# Altium schematic sheet TEC_Laser.SchDoc
size A3; SheetNumber: 1; SheetTotal: 1
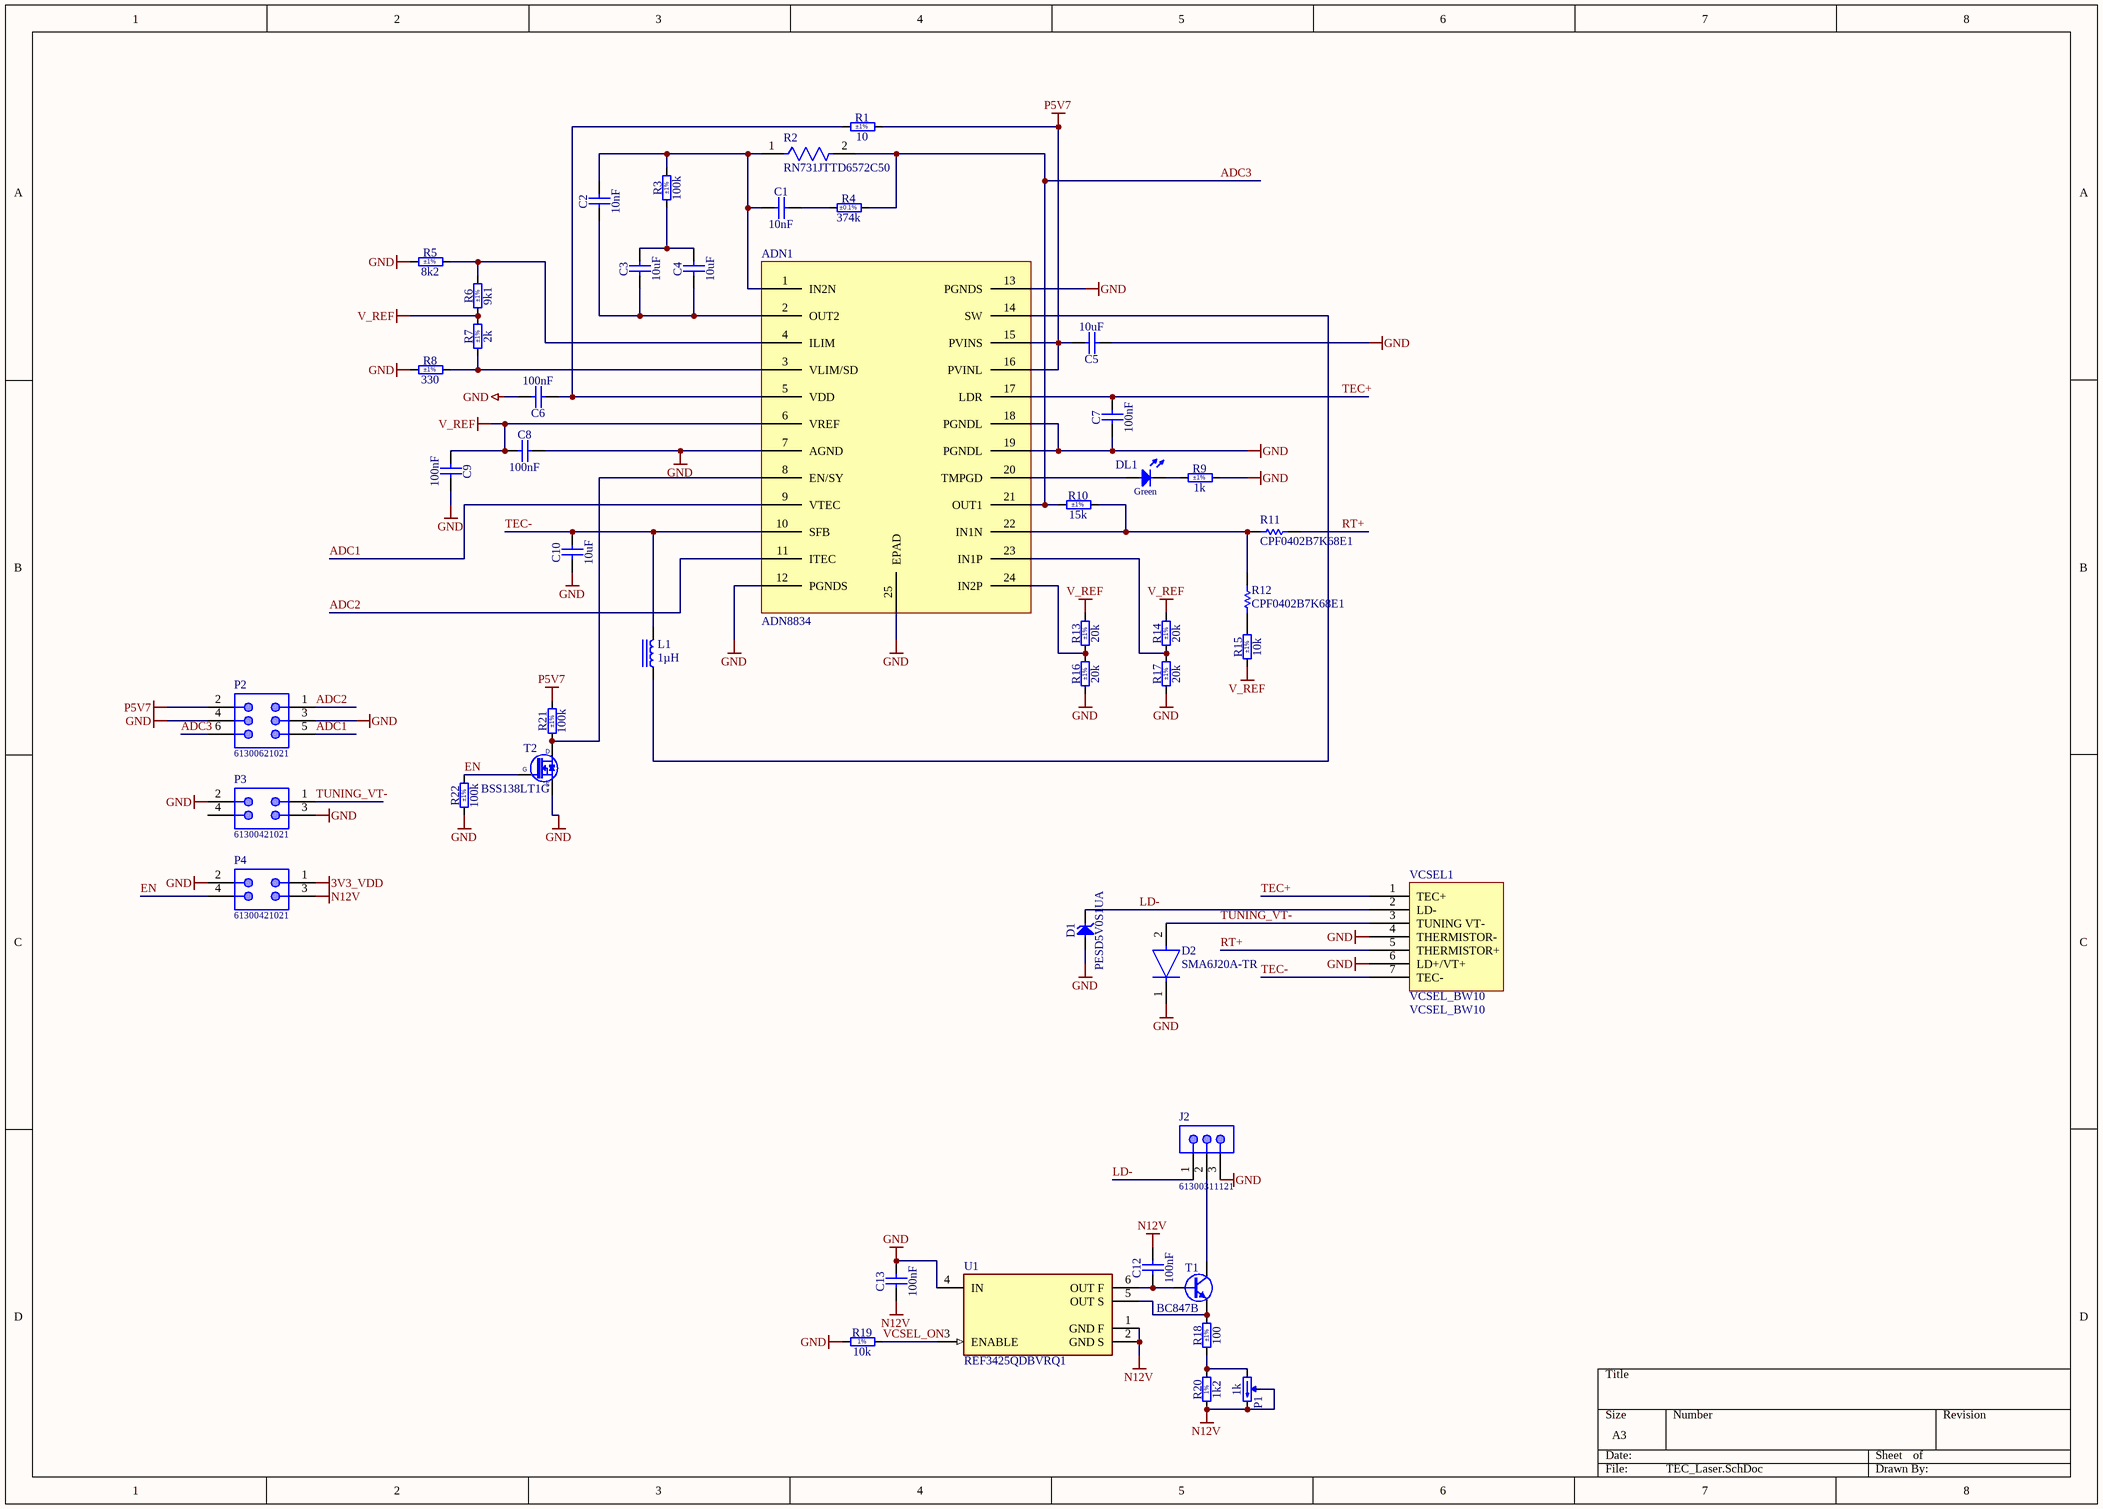
[diagram p0: TEC_Laser.SchDoc]

## Parts
ADN1  ADN8834  [SMSC QFN-24 4x4MM]
C1  10nF  [CAPC1005X55N]
C2  10nF  [CAPC1005X55N]
C3  10uF  [CAPC1608X80N]
C4  10uF  [CAPC1608X80N]
C5  10uF  [CAPC1005X70N]
C6  100nF  [CAPC1005X55N]
C7  100nF  [CAPC1005X55N]
C8  100nF  [CAPC1005X55N]
C9  100nF  [CAPC1005X55N]
C10  10uF  [CAPC1005X70N]
C12  100nF  [CAPC1005X55N]
C13  100nF  [CAPC1005X55N]
D1  PESD5V0S1UA  [SOD2512X110N]
D2  SMA6J20A-TR  [FP-SMA-MFG]
DL1  Green  [LED_OSRAM_LGL29K]
J2  61300311121  [61300311121]
L1  1µH  [IND 0806_2016]
P1  1k  [TRIM_VISHAY_T63XB]
P2  61300621021  [61300621021]
P3  61300421021  [61300421021]
P4  61300421021  [61300421021]
R1  10  Tolerance: ±1%  [RESC1005X40N]
R2  RN731JTTD6572C50  [FP-RN731J-IPC_B]
R3  100k  Tolerance: ±1%  [RESC1005X40N]
R4  374k  Tolerance: ±0.1%  [RESC1608X55N]
R5  8k2  Tolerance: ±1%  [RESC1005X40N]
R6  9k1  Tolerance: ±1%  [RESC1005X40N]
R7  2k  Tolerance: ±1%  [RESC1005X40N]
R8  330  Tolerance: ±1%  [RESC1005X40N]
R9  1k  Tolerance: ±1%  [RESC1005X40N]
R10  15k  Tolerance: ±1%  [RESC1005X40N]
R11  CPF0402B7K68E1  [RESC1005X35X20NL05T10]
R12  CPF0402B7K68E1  [RESC1005X35X20NL05T10]
R13  20k  Tolerance: ±1%  [RESC1005X40N]
R14  20k  Tolerance: ±1%  [RESC1005X40N]
R15  10k  Tolerance: ±1%  [RESC1005X40N]
R16  20k  Tolerance: ±1%  [RESC1005X40N]
R17  20k  Tolerance: ±1%  [RESC1005X40N]
R18  100  Tolerance: ±1%  [RESC1005X40N]
R19  10k  [RESC1005X40N]
R20  1k2  [RESC1005X40N]
R21  100k  Tolerance: ±1%  [RESC1005X40N]
R22  100k  Tolerance: ±1%  [RESC1005X40N]
T1  BC847B  [SOT95P230X110-3N]
T2  BSS138LT1G  [SOT95P240X110-3N]
U1  REF3425QDBVRQ1  [FP-DBV0006A-MFG]
VCSEL1  VCSEL_BW10  [VCSEL_BW10]

## Nets
3V3_VDD: P4.1
GND: ADN1.7(AGND) ADN1.12(PGNDS) ADN1.13(PGNDS) ADN1.18(PGNDL) ADN1.19(PGNDL) ADN1.25(EPAD) C5.1 C6.2 C7.1 C8.2 C9.2 C10.1 C13.2 D1.2(A) D2.1(C) J2.3 P2.3 P2.4 P3.2 P3.3 P4.2 R5.1 R8.1 R9.2 R16.1 R17.1 R19.1 R22.1 T2.2(S) U1.4(IN) VCSEL1.4(THERMISTOR-) VCSEL1.6(LD+/VT+)
N12V: C12.2 C13.1 P1.2(W) P1.3(CW) P4.3 R20.1 U1.1(GND_F) U1.2(GND_S)
P5V7: ADN1.15(PVINS) ADN1.16(PVINL) C5.2 P2.2 R1.2 R21.2
V_REF: ADN1.6(VREF) C8.1 C9.1 R6.1 R7.2 R13.2 R14.2 R15.1
ADC1: ADN1.9(VTEC) P2.5
ADC2: ADN1.11(ITEC) P2.1
ADC3: ADN1.21(OUT1) P2.6 R2.2 R4.2 R10.1
EN: P4.4 R22.2 T2.1(G)
LD-: D1.1(C) J2.1 VCSEL1.2(LD-)
RT+: R11.2 VCSEL1.5(THERMISTOR+)
TEC+: ADN1.17(LDR) C7.2 VCSEL1.1(TEC+)
TEC-: ADN1.10(SFB) C10.2 L1.2 VCSEL1.7(TEC-)
TUNING_VT-: D2.2(A) P3.1 VCSEL1.3(TUNING_VT-)
VCSEL_ON: R19.2 U1.3(ENABLE)
NetADN1_1: ADN1.1(IN2N) C1.1 C2.2 R2.1 R3.2
NetADN1_2: ADN1.2(OUT2) C2.1 C3.1 C4.1
NetADN1_3: ADN1.3(VLIM/SD) R7.1 R8.2
NetADN1_4: ADN1.4(ILIM) R5.2 R6.2
NetADN1_5: ADN1.5(VDD) C6.1 R1.1
NetADN1_8: ADN1.8(EN/SY) R21.1 T2.3(D)
NetADN1_14: ADN1.14(SW) L1.1
NetADN1_20: ADN1.20(TMPGD) DL1.2(A)
NetADN1_22: ADN1.22(IN1N) R10.2 R11.1 R12.2
NetADN1_23: ADN1.23(IN1P) R14.1 R17.2
NetADN1_24: ADN1.24(IN2P) R13.1 R16.2
NetC1_2: C1.2 R4.1
NetC3_2: C3.2 C4.2 R3.1
NetC12_1: C12.1 T1.1(B) U1.6(OUT_F)
NetDL1_1: DL1.1(C) R9.1
NetJ2_2: J2.2 T1.3(C)
NetP1_1: P1.1(CCW) R18.1 R20.2
NetR12_1: R12.1 R15.2
NetR18_2: R18.2 T1.2(E) U1.5(OUT_S)

Not connected (* = marked no-connect by the designer): P3 4

## Notes on the sheet
- (in symbol R0402_1K2_1%_0.0625W_100PPM) 1%
- (in symbol R0402_10K_1%_0.0625W_100PPM) 1%

## Library data of the parts
ADN1 = ADN8834: TEC
C1 C2 = CC0402_10NF_16V_10%_X7R: Non-polarised capacitor; Part Description: SMD Multilayer Chip Ceramic Capacitor; Manufacturer: GENERIC; Manufacturer1 Part Number: 223878715636; Voltage: 16V; TC: X7R; Tolerance: ±10%; Part Number: CC0402_10NF_16V_10%_X7R; Component Kind: Standard; Component Type: Standard; Pin Count: 2; Value: 10nF; Status: Not Recommended; Manufacturer Part Number: CC0402_10NF_16V_10%_X7R; Case: 0402; Mounted: Yes; Socket: No; SMD: Yes; Sense: No; Manufacturer1 Example: PHYCOMP; Manufacturer1 ComponentHeight: 0.55mm; HelpURL: \\cern.ch\dfs\Applications\Altium\Datasheets\CC0402_X7R_PHYCOMP.pdf; Author: CERN DEM JLC; CreateDate: 03.12.2007; LatestRevisionDate: 03.12.2007
C3 C4 = CC0603_10UF_16V_20%_X5R: Non-polarised capacitor; Part Description: SMD Multilayer Chip Ceramic Capacitor; Manufacturer: GENERIC; Manufacturer1 Part Number: GRM188R61C106MA73D; Voltage: 16V; TC: X5R; Tolerance: ±20%; Part Number: CC0603_10UF_16V_20%_X5R; Component Kind: Standard; Component Type: Standard; Pin Count: 2; Value: 10uF; Status: None; Manufacturer Part Number: CC0603_10UF_16V_20%_X5R; Case: 0603; Mounted: Yes; Socket: No; SMD: Yes; Sense: No; Manufacturer1 Example: MURATA; Manufacturer1 ComponentHeight: 0.8mm; HelpURL: \\cern.ch\dfs\Applications\Altium\Datasheets\CC0603_X5R_MURATA_GRM.pdf; Author: CERN DEM MR; CreateDate: 02.03.2016; LatestRevisionDate: 02.03.2016
C5 C10 = CC0402_10UF_6.3V_20%_X5R: Non-polarised capacitor; Part Description: SMD Multilayer Chip Ceramic Capacitor; Manufacturer: GENERIC; Manufacturer1 Part Number: C1005X5R0J106M050BC; Voltage: 6.3V; TC: X5R; Tolerance: ±10%; Part Number: CC0402_10UF_6.3V_20%_X5R; Component Kind: Standard; Component Type: Standard; Pin Count: 2; Value: 10uF; Status: Preferred; Manufacturer Part Number: CC0402_10UF_6.3V_20%_X5R; Case: 0402; Mounted: Yes; Socket: No; SMD: Yes; Sense: No; Manufacturer1 Example: TDK; Manufacturer1 ComponentHeight: 0.70mm; HelpURL: \\cern.ch\dfs\Applications\Altium\Datasheets\CC0402_X5R_TDK_C.pdf; Author: CERN DEM JLC; CreateDate: 07.01.2015; LatestRevisionDate: 07.01.2015
C6-C9 C12 C13 = CC0402_100NF_16V_10%_X7R: Non-polarised capacitor; Part Description: SMD Multilayer Chip Ceramic Capacitor; Manufacturer: GENERIC; Manufacturer1 Part Number: GRM155R71C104KA88D; Voltage: 16V; TC: X7R; Tolerance: ±10%; Part Number: CC0402_100NF_16V_10%_X7R; Component Kind: Standard; Component Type: Standard; Pin Count: 2; Value: 100nF; Status: Not Recommended; Manufacturer Part Number: CC0402_100NF_16V_10%_X7R; Case: 0402; Mounted: Yes; Socket: No; SMD: Yes; Sense: No; Manufacturer1 Example: MURATA; Manufacturer1 ComponentHeight: 0.55mm; HelpURL: \\cern.ch\dfs\Applications\Altium\Datasheets\CC0402_X7R_MURATA_GRM.pdf; Author: CERN DEM JLC; CreateDate: 05.12.2013; LatestRevisionDate: 03.12.2007
D1 = PESD5V0S1UA: Transient Voltage Suppressor Diode (Uni-Directional); Part Description: Unidirectional ESD Protection for Transient Voltage Suppression; Manufacturer: NXP SEMICONDUCTORS; Voltage: 5V; Power: 890W; PressFit: No; Bonding: No; Part Number: PESD5V0S1UA; Component Kind: Standard; Component Type: Standard; Device: PESD5V0S1UA; PackageDescription: Small Outline Diode (SOD-323), 1.70mm W X 1.25mm L X 1.10mm H body,  IPC Medium Density; Manufacturer Part Number: PESD5V0S1UA; Pin Count: 2; Case: SOD-323; Mounted: Yes; Socket: No; SMD: Yes; Sense: No; ComponentHeight: 1.1mm; HelpURL: \\cern.ch\dfs\Applications\Altium\Datasheets\PESD5V0S1UA.pdf; Author: CERN DEM JLC; CreateDate: 28.08.2012; LatestRevisionDate: 18.09.2013
D2 = CMP-12225-000059-1: TVS DIODE 20V 36.8V SMA; Number of Unidirectional Channels: 1; Leakage Current: 200nA; Power Dissipation: 600W; Max Breakdown Voltage: 24.5V; Max Power Dissipation: 4W; Reverse Breakdown Voltage: 22.2V; Element Configuration: Single; Power Line Protection: No; Test Current: 1mA; Peak Pulse Current: 93A; Polarity: Unidirectional; Breakdown Voltage: 23.4V; Max Surge Current: 60A; Width: 2.9mm; Termination: SMD/SMT; Reverse Standoff Voltage: 20V; Radiation Hardening: No; Max Operating Temperature: 175°C; Package Quantity: 1; Lead Free: Lead Free; Number of Elements: 1; Length: 4.6mm; Case/Package: SMA; Mount: Surface Mount; Max Reverse Leakage Current: 200nA; Number of Channels: 1; Clamping Voltage: 36.8V; REACH SVHC: No SVHC; Number of Pins: 2; Peak Pulse Power: 600W; Min Breakdown Voltage: 22.2V; Height: 2.03mm; Operating Supply Voltage: 20V; Min Operating Temperature: -55°C; Packaging: Tape and Reel; Direction: Unidirectional; Composition: Zener
DL1 = LED_OSRAM_LG L29K-G2J1-24-Z: LED Green 1C 2A; Part Description: Surface Mount Green LED (0603 Case); Manufacturer: OSRAM; PressFit: No; Bonding: No; Status Comment: Sourcing Difficulty; Part Number: LED_OSRAM_LG L29K-G2J1-24-Z; Component Kind: Standard; Component Type: Standard; Color: Green; PackageDescription: Green Chip LED, 2-Leads, Body 1.7x0.8mm, IPC Medium Density; Manufacturer Part Number: LG L29K-G2J1-24-Z; Pin Count: 2; Case: 0603; Mounted: Yes; Socket: No; SMD: Yes; Sense: No; ComponentHeight: 0.67mm; HelpURL: \\cern.ch\dfs\Applications\Altium\Datasheets\LED_OSRAM_LGL29K.pdf; Author: CERN DEM JLC; CreateDate: 24.04.2012; LatestRevisionDate: 24.04.2012; Status: Not Recommended
J2 = 61300311121: WR-PHD Pin Header, THT, pitch 2.54mm, Single Row, Vertical, 3pin; Pin Number: 3; Gender: Male; Rated Current: 3A; Working Voltage: 250VAC; Withstanding Voltage: 500VAC; Contact Resistance: 20mOhm; ComponentLink1Description: Manufacturer; ComponentLink1URL: http://www.we-online.de; ComponentLink2Description: Datasheet; ComponentLink2URL: https://katalog.we-online.de/em/datasheet/6130xx11121.pdf; Part Number: 61300311121; Published Date: June 2019; Publisher: Wurth Elektronik; Pitch: 2.54mm; Operating Temperature: -40 to +105degC; Mounting Technology: THT; Packaging: Bag; Row Number: Single; Orientation: Vertical
L1 = SDED20161T-1R0MS: FIXED IND 1UH 1.7A 107MOHM SMD; Manufacturer: Delta Electronics/Cyntec; Current - Saturation: 1.8A; DC Resistance (DCR): 107mOhm Max; Inductance Frequency - Test: 1MHz; Material - Core: 0806 (2016 Metric); Shielding: Shielded; Tolerance: ±20%; Part Number: SDED20161T-1R0MS; ComponentLink1Description: Datasheet; ComponentLink1URL: http://www.cyntec.com/upfile/products/download/SDED20161T-000%20(A6).pdf; ComponentLink2Description: DigiKey Link; ComponentLink2URL: http://digikey.com/product-detail/en/delta-electronics-cyntec/SDED20161T-1R0MS/2037-SDED20161T-1R0MSCT-ND/10315404; Current Rating (Amps): 1.7A; Device Package: 0806 (2016 Metric); Height - Seated (Max): 0.039" (1.00mm); Inductance: 1µH; LastUpdated: 02.09.2020 01:24:38; Lifecycle Status: Active; Minimum Order: 1; Mounting Type: Surface Mount; Operating Temperature: -55°C ~ 125°C; Package / Case: 0806 (2016 Metric); Packaging: TapeAndReel; PartId: 2787; Part Status: Active; Price: 0.09; Series: SDED20161T; Size / Dimension: 0.079" L x 0.063" W (2.00mm x 1.60mm); Supplier 1: DigiKey; Supplier Part Number 1: 2037-SDED20161T-1R0MSCT-ND; Supplier Device Package: 0806; Value: 1µH
P1 = TRIM_14T_1K_VISHAY_T63XB102KT20: Trimming Potentiometer; Part Description: 15 Turn ± 5 Trimming Potentiometer (Side Adjustment); Manufacturer: VISHAY SFERNICE; Power: 0.25W; TC: ±100ppm/°C; Tolerance: ±10%; PressFit: No; Part Number: TRIM_14T_1K_VISHAY_T63XB102KT20; Component Kind: Standard; Component Type: Standard; Pin Count: 3; Value: 1k; Manufacturer Part Number: T63XB102KT20; Case: T63XB; Mounted: Yes; Socket: No; SMD: No; Sense: No; ComponentHeight: 7mm; HelpURL: \\cern.ch\dfs\Applications\Altium\Datasheets\TRIM_VISHAY_T63XB.pdf; Author: CERN DEM JLC; CreateDate: 16.10.2013; LatestRevisionDate: 16.10.2013
P2 = 61300621021: WR-PHD Pin Header, THT, pitch 2.54mm, Dual Row, Angled, 6p; Manufacturer: Wurth Elektronik; Pin Number: 6; Rated Current: 3A; Working Voltage: 250VAC; Withstanding Voltage: 500VAC; Contact Resistance: 20mOhm; ComponentLink1Description: Manufacturer; ComponentLink1URL: http://www.we-online.de; ComponentLink2Description: Datasheet; ComponentLink2URL: https://www.we-online.com/catalog/datasheet/61300621021.pdf; Manufacturer Part Number: 61300621021; Published Date: May 2020; Pitch: 2.54mm; Operating Temperature: -40 to +105degC; Mounting Technology: THT; Packaging: Bag; Gender: Pin Header; Row Number: Dual; Orientation: Angled
P3 P4 = 61300421021: WR-PHD Pin Header, THT, pitch 2.54mm, Dual Row, Angled, 4p; Manufacturer: Wurth Elektronik; Pin Number: 4; Rated Current: 3A; Working Voltage: 250VAC; Withstanding Voltage: 500VAC; Contact Resistance: 20mOhm; ComponentLink1Description: Manufacturer; ComponentLink1URL: http://www.we-online.de; ComponentLink2Description: Datasheet; ComponentLink2URL: https://www.we-online.com/catalog/datasheet/61300421021.pdf; Manufacturer Part Number: 61300421021; Published Date: May 2020; Pitch: 2.54mm; Operating Temperature: -40 to +105degC; Mounting Technology: THT; Packaging: Bag; Gender: Pin Header; Row Number: Dual; Orientation: Angled
R1 = R0402_10R_1%_0.0625W_200PPM: Resistor - 1%; Part Description: General Purpose Thick Film Chip Resistor; Manufacturer: GENERIC; Manufacturer1 Part Number: 232270671009L; TC: ±200ppm/°C; PressFit: No; Part Number: R0402_10R_1%_0.0625W_200PPM; Component Kind: Standard; Component Type: Standard; Pin Count: 2; Value: 10; Status: Not Recommended; Power: 0.0625W; Manufacturer Part Number: R0402_10R_1%_0.0625W_200PPM; Case: 0402; Mounted: Yes; Sense: No; Socket: No; SMD: Yes; Manufacturer1 Example: YAGEO PHYCOMP; Manufacturer1 ComponentHeight: 0.4mm; HelpURL: \\cern.ch\dfs\Applications\Altium\Datasheets\R0402_Phycomp_RC0402.pdf; Author: CERN DEM JLC; CreateDate: 24.06.2009; LatestRevisionDate: 17.10.2012
R2 = CMP-04015-036220-1: 65.7kΩ ±0.25% 0.063W, 1/16W Chip Resistor 0603 (1608 Metric) Moisture Resistant Thin Film; Voltage Rating: 50V; Resistance: 65.7kR; Temperature Coefficient: 50ppm/°C; Power Rating: 63mW; Case Code (Metric): 1608; Length: 1.6mm; Packaging: Tape and Reel; Case/Package: 0603; Case Code (Imperial): 0603; Weight: 7.1E-05oz; Composition: Thin Film; Height: 0.45mm; Tolerance: 0.25%; Termination: SMD/SMT; Width: 0.8mm; Min Operating Temperature: -55°C; Max Operating Temperature: 125°C
R3 R21 R22 = R0402_100K_1%_0.0625W_100PPM: Resistor - 1%; Part Description: General Purpose Thick Film Chip Resistor; Manufacturer: GENERIC; Manufacturer1 Part Number: 232270671004L; TC: ±100ppm/°C; PressFit: No; Part Number: R0402_100K_1%_0.0625W_100PPM; Component Kind: Standard; Component Type: Standard; Pin Count: 2; Value: 100k; Status: Not Recommended; Power: 0.0625W; Manufacturer Part Number: R0402_100K_1%_0.0625W_100PPM; Case: 0402; Mounted: Yes; Sense: No; Socket: No; SMD: Yes; Manufacturer1 Example: YAGEO PHYCOMP; Manufacturer1 ComponentHeight: 0.4mm; HelpURL: \\cern.ch\dfs\Applications\Altium\Datasheets\R0402_Phycomp_RC0402.pdf; Author: CERN DEM JLC; CreateDate: 03.12.2007; LatestRevisionDate: 17.10.2012
R4 = R0603_374K_0.1%_0.063W_25PPM: Resistor - 0.1%; Part Description: Thin Film Chip Resistor; Manufacturer: GENERIC; Manufacturer1 Part Number: CPF0603B374KE1; Power: 0.063W; TC: ±25ppm; PressFit: No; Part Number: R0603_374K_0.1%_0.063W_25PPM; Component Kind: Standard; Component Type: Standard; Pin Count: 2; Value: 374k; Status: Not Recommended; Manufacturer Part Number: R0603_374K_0.1%_0.063W_25PPM; Case: 0603; Mounted: Yes; Sense: No; Socket: No; SMD: Yes; Manufacturer1 Example: TYCO ELECTRONICS; Manufacturer1 ComponentHeight: 0.55mm; HelpURL: \\cern.ch\dfs\Applications\Altium\Datasheets\R0603_TYCO_CPF.pdf; Author: CERN DEM JLC; CreateDate: 12.01.2011; LatestRevisionDate: 12.01.2011
R5 = R0402_8K2_1%_0.0625W_100PPM: Resistor - 1%; Part Description: General Purpose Thick Film Chip Resistor; Manufacturer: GENERIC; Manufacturer1 Part Number: 232270678202L; TC: ±100ppm/°C; PressFit: No; Part Number: R0402_8K2_1%_0.0625W_100PPM; Component Kind: Standard; Component Type: Standard; Pin Count: 2; Value: 8k2; Status: Not Recommended; Power: 0.0625W; Manufacturer Part Number: R0402_8K2_1%_0.0625W_100PPM; Case: 0402; Mounted: Yes; Sense: No; Socket: No; SMD: Yes; Manufacturer1 Example: YAGEO PHYCOMP; Manufacturer1 ComponentHeight: 0.4mm; HelpURL: \\cern.ch\dfs\Applications\Altium\Datasheets\R0402_Phycomp_RC0402.pdf; Author: CERN DEM JLC; CreateDate: 03.12.2007; LatestRevisionDate: 17.10.2012
R6 = R0402_9K1_1%_0.0625W_100PPM: Resistor - 1%; Part Description: General Purpose Thick Film Chip Resistor; Manufacturer: GENERIC; Manufacturer1 Part Number: 232270679102L; TC: ±100ppm/°C; PressFit: No; Part Number: R0402_9K1_1%_0.0625W_100PPM; Component Kind: Standard; Component Type: Standard; Pin Count: 2; Value: 9k1; Status: Not Recommended; Power: 0.0625W; Manufacturer Part Number: R0402_9K1_1%_0.0625W_100PPM; Case: 0402; Mounted: Yes; Sense: No; Socket: No; SMD: Yes; Manufacturer1 Example: YAGEO PHYCOMP; Manufacturer1 ComponentHeight: 0.4mm; HelpURL: \\cern.ch\dfs\Applications\Altium\Datasheets\R0402_Phycomp_RC0402.pdf; Author: CERN DEM JLC; CreateDate: 03.12.2007; LatestRevisionDate: 17.10.2012
R7 = R0402_2K_1%_0.0625W_100PPM: Resistor - 1%; Part Description: General Purpose Thick Film Chip Resistor; Manufacturer: GENERIC; Manufacturer1 Part Number: 232270672002L; TC: ±100ppm/°C; PressFit: No; Part Number: R0402_2K_1%_0.0625W_100PPM; Component Kind: Standard; Component Type: Standard; Pin Count: 2; Value: 2k; Status: Not Recommended; Power: 0.0625W; Manufacturer Part Number: R0402_2K_1%_0.0625W_100PPM; Case: 0402; Mounted: Yes; Sense: No; Socket: No; SMD: Yes; Manufacturer1 Example: YAGEO PHYCOMP; Manufacturer1 ComponentHeight: 0.4mm; HelpURL: \\cern.ch\dfs\Applications\Altium\Datasheets\R0402_Phycomp_RC0402.pdf; Author: CERN DEM JLC; CreateDate: 03.12.2007; LatestRevisionDate: 17.10.2012
R8 = R0402_330R_1%_0.0625W_100PPM: Resistor - 1%; Part Description: General Purpose Thick Film Chip Resistor; Manufacturer: GENERIC; Manufacturer1 Part Number: 232270673301L; TC: ±100ppm/°C; PressFit: No; Part Number: R0402_330R_1%_0.0625W_100PPM; Component Kind: Standard; Component Type: Standard; Pin Count: 2; Value: 330; Status: Not Recommended; Power: 0.0625W; Manufacturer Part Number: R0402_330R_1%_0.0625W_100PPM; Case: 0402; Mounted: Yes; Sense: No; Socket: No; SMD: Yes; Manufacturer1 Example: YAGEO PHYCOMP; Manufacturer1 ComponentHeight: 0.4mm; HelpURL: \\cern.ch\dfs\Applications\Altium\Datasheets\R0402_Phycomp_RC0402.pdf; Author: CERN DEM JLC; CreateDate: 03.12.2007; LatestRevisionDate: 17.10.2012
R9 = R0402_1K_1%_0.0625W_100PPM: Resistor - 1%; Part Description: General Purpose Thick Film Chip Resistor; Manufacturer: GENERIC; Manufacturer1 Part Number: 232270671002L; TC: ±100ppm/°C; PressFit: No; Part Number: R0402_1K_1%_0.0625W_100PPM; Component Kind: Standard; Component Type: Standard; Pin Count: 2; Value: 1k; Status: Not Recommended; Power: 0.0625W; Manufacturer Part Number: R0402_1K_1%_0.0625W_100PPM; Case: 0402; Mounted: Yes; Sense: No; Socket: No; SMD: Yes; Manufacturer1 Example: YAGEO PHYCOMP; Manufacturer1 ComponentHeight: 0.4mm; HelpURL: \\cern.ch\dfs\Applications\Altium\Datasheets\R0402_Phycomp_RC0402.pdf; Author: CERN DEM JLC; CreateDate: 03.12.2007; LatestRevisionDate: 17.10.2012
R10 = R0402_15K_1%_0.0625W_100PPM: Resistor - 1%; Part Description: General Purpose Thick Film Chip Resistor; Manufacturer: GENERIC; Manufacturer1 Part Number: CRCW040215K0FKED; TC: ±100ppm/°C; PressFit: No; Part Number: R0402_15K_1%_0.0625W_100PPM; Component Kind: Standard; Component Type: Standard; Pin Count: 2; Value: 15k; Status: None; Power: 0.0625W; Manufacturer Part Number: R0402_15K_1%_0.0625W_100PPM; Case: 0402; Mounted: Yes; Sense: No; Socket: No; SMD: Yes; Manufacturer1 Example: VISHAY; Manufacturer1 ComponentHeight: 0.4mm; HelpURL: \\cern.ch\dfs\Applications\Altium\Datasheets\R0402_VISHAY_CRCW e3.pdf; Author: CERN DEM JMW; CreateDate: 06.07.2015; LatestRevisionDate: 06.07.2015
R11 R12 = CMP-2002-03387-1: Manufacturer: TE Connectivity / AMP; Part Number: CPF0402B7K68E1
R13 R14 R16 R17 = R0402_20K_1%_0.0625W_100PPM: Resistor - 1%; Part Description: General Purpose Thick Film Chip Resistor; Manufacturer: GENERIC; Manufacturer1 Part Number: 232270672003L; TC: ±100ppm/°C; PressFit: No; Part Number: R0402_20K_1%_0.0625W_100PPM; Component Kind: Standard; Component Type: Standard; Pin Count: 2; Value: 20k; Status: Not Recommended; Power: 0.0625W; Manufacturer Part Number: R0402_20K_1%_0.0625W_100PPM; Case: 0402; Mounted: Yes; Sense: No; Socket: No; SMD: Yes; Manufacturer1 Example: YAGEO PHYCOMP; Manufacturer1 ComponentHeight: 0.4mm; HelpURL: \\cern.ch\dfs\Applications\Altium\Datasheets\R0402_Phycomp_RC0402.pdf; Author: CERN DEM JLC; CreateDate: 03.12.2007; LatestRevisionDate: 17.10.2012
R15 R19 = R0402_10K_1%_0.0625W_100PPM: Resistor - 1%; Part Description: General Purpose Thick Film Chip Resistor; Manufacturer: GENERIC; Manufacturer1 Part Number: 232270671003L; TC: ±100ppm/°C; PressFit: No; Part Number: R0402_10K_1%_0.0625W_100PPM; Component Kind: Standard; Component Type: Standard; Pin Count: 2; Value: 10k; Status: Not Recommended; Power: 0.0625W; Manufacturer Part Number: R0402_10K_1%_0.0625W_100PPM; Case: 0402; Mounted: Yes; Sense: No; Socket: No; SMD: Yes; Manufacturer1 Example: YAGEO PHYCOMP; Manufacturer1 ComponentHeight: 0.4mm; HelpURL: \\cern.ch\dfs\Applications\Altium\Datasheets\R0402_Phycomp_RC0402.pdf; Author: CERN DEM JLC; CreateDate: 03.12.2007; LatestRevisionDate: 17.10.2012
  R19: Tolerance: ±1%
R18 = R0402_100R_1%_0.0625W_100PPM: Resistor - 1%; Part Description: General Purpose Thick Film Chip Resistor; Manufacturer: GENERIC; Manufacturer1 Part Number: 232270671001L; TC: ±100ppm/°C; PressFit: No; Part Number: R0402_100R_1%_0.0625W_100PPM; Component Kind: Standard; Component Type: Standard; Pin Count: 2; Value: 100; Status: Not Recommended; Power: 0.0625W; Manufacturer Part Number: R0402_100R_1%_0.0625W_100PPM; Case: 0402; Mounted: Yes; Sense: No; Socket: No; SMD: Yes; Manufacturer1 Example: YAGEO PHYCOMP; Manufacturer1 ComponentHeight: 0.4mm; HelpURL: \\cern.ch\dfs\Applications\Altium\Datasheets\R0402_Phycomp_RC0402.pdf; Author: CERN DEM JLC; CreateDate: 03.12.2007; LatestRevisionDate: 17.10.2012
R20 = R0402_1K2_1%_0.0625W_100PPM: Resistor - 1%; Part Description: General Purpose Thick Film Chip Resistor; Manufacturer: GENERIC; Manufacturer1 Part Number: 232270671202L; TC: ±100ppm/°C; PressFit: No; Part Number: R0402_1K2_1%_0.0625W_100PPM; Component Kind: Standard; Component Type: Standard; Pin Count: 2; Value: 1k2; Status: Not Recommended; Power: 0.0625W; Tolerance: ±1%; Manufacturer Part Number: R0402_1K2_1%_0.0625W_100PPM; Case: 0402; Mounted: Yes; Sense: No; Socket: No; SMD: Yes; Manufacturer1 Example: YAGEO PHYCOMP; Manufacturer1 ComponentHeight: 0.4mm; HelpURL: \\cern.ch\dfs\Applications\Altium\Datasheets\R0402_Phycomp_RC0402.pdf; Author: CERN DEM JLC; CreateDate: 03.12.2007; LatestRevisionDate: 17.10.2012
T1 = BC847B: NPN Transistor; Part Description: 45V 100mA NPN general-purpose transistors; Manufacturer: NXP SEMICONDUCTORS; PressFit: No; Bonding: No; Part Number: BC847B; Component Kind: Standard; Component Type: Standard; Device: BC847B; PackageDescription: SOT23, 0.95mm Pitch; 3 Pin, 1.30mm W X 2.90mm L X 1.10mm H body, IPC Medium Density; Manufacturer Part Number: BC847B; Pin Count: 3; Case: SOT23-3; Mounted: Yes; Socket: No; SMD: Yes; Sense: No; ComponentHeight: 1.1mm; HelpURL: \\cern.ch\dfs\Applications\Altium\Datasheets\BC847B.pdf; Author: CERN DEM JLC; CreateDate: 14.06.2011; LatestRevisionDate: 14.06.2011
T2 = BSS138LT1G: N-CHANNEL MOSFET WITH DIODE; Part Description: 50V 200mA N-Channel Enhancement Mode Field-Effect Transistor; Manufacturer: ON SEMICONDUCTOR; PressFit: No; Bonding: No; Part Number: BSS138LT1G; Component Kind: Standard; Component Type: Standard; Device: BSS138LT1G; PackageDescription: SOT23, 0.95mm Pitch; 3 Pin, 1.40mm W X 3.00mm L X 1.10mm H body, IPC Medium Density; Manufacturer Part Number: BSS138LT1G; Pin Count: 3; Case: SOT23-3; Mounted: Yes; Socket: No; SMD: Yes; Sense: No; ComponentHeight: 1.11mm; HelpURL: \\cern.ch\dfs\Applications\Altium\Datasheets\BSS138LT1G.pdf; Author: CERN DEM JLC; CreateDate: 23.03.2009; LatestRevisionDate: 23.03.2009
U1 = CMP-04916-000005-1: IC VREF SERIES 0.05% SOT23-6; Manufacturer: Texas Instruments; Output Voltage: 2.5V; Max Supply Voltage: 12V; Output Type: Fixed; Automotive Grade: Grade 1; Number Of Outputs: 1; Output Current: 10mA; Nominal Supply Current: 72uA; Standoff Height: 0mm; Temperature: -40°C to +125°C; Temperature Range Low: -40°C; ComponentLink2Description: Datasheet; Manufacturer Part Number: REF3425QDBVRQ1; Device Class L2: Power Management ICs; RoHS: TRUE; Temperature Range High: +125°C; Digikey Description: IC VREF SERIES 0.05% SOT23-6; Octopart: https://octopart.com/ref3433qdbvrq1-texas+instruments-95842010; ComponentLink2URL: https://www.ti.com/lit/ds/symlink/ref34-q1.pdf; Mouser Description: Automotive low-drift low-power small-footprint series voltage reference 6-SOT-23 -40 to 125; Package: DBV0006A; Ambient Temperature Range High: +125°C; Device Class L1: Integrated Circuits (ICs); Device Class L3: Voltage References; Category: IC; Height: 1.45mm; Lead Free: Yes; Automotive: Yes; Reference Type: Series; Ambient Temperature Range Low: -40°C
VCSEL1 = VCSLE_BW10